# EAGLE design stm32f072-breakout (EAGLE 7.2.0)
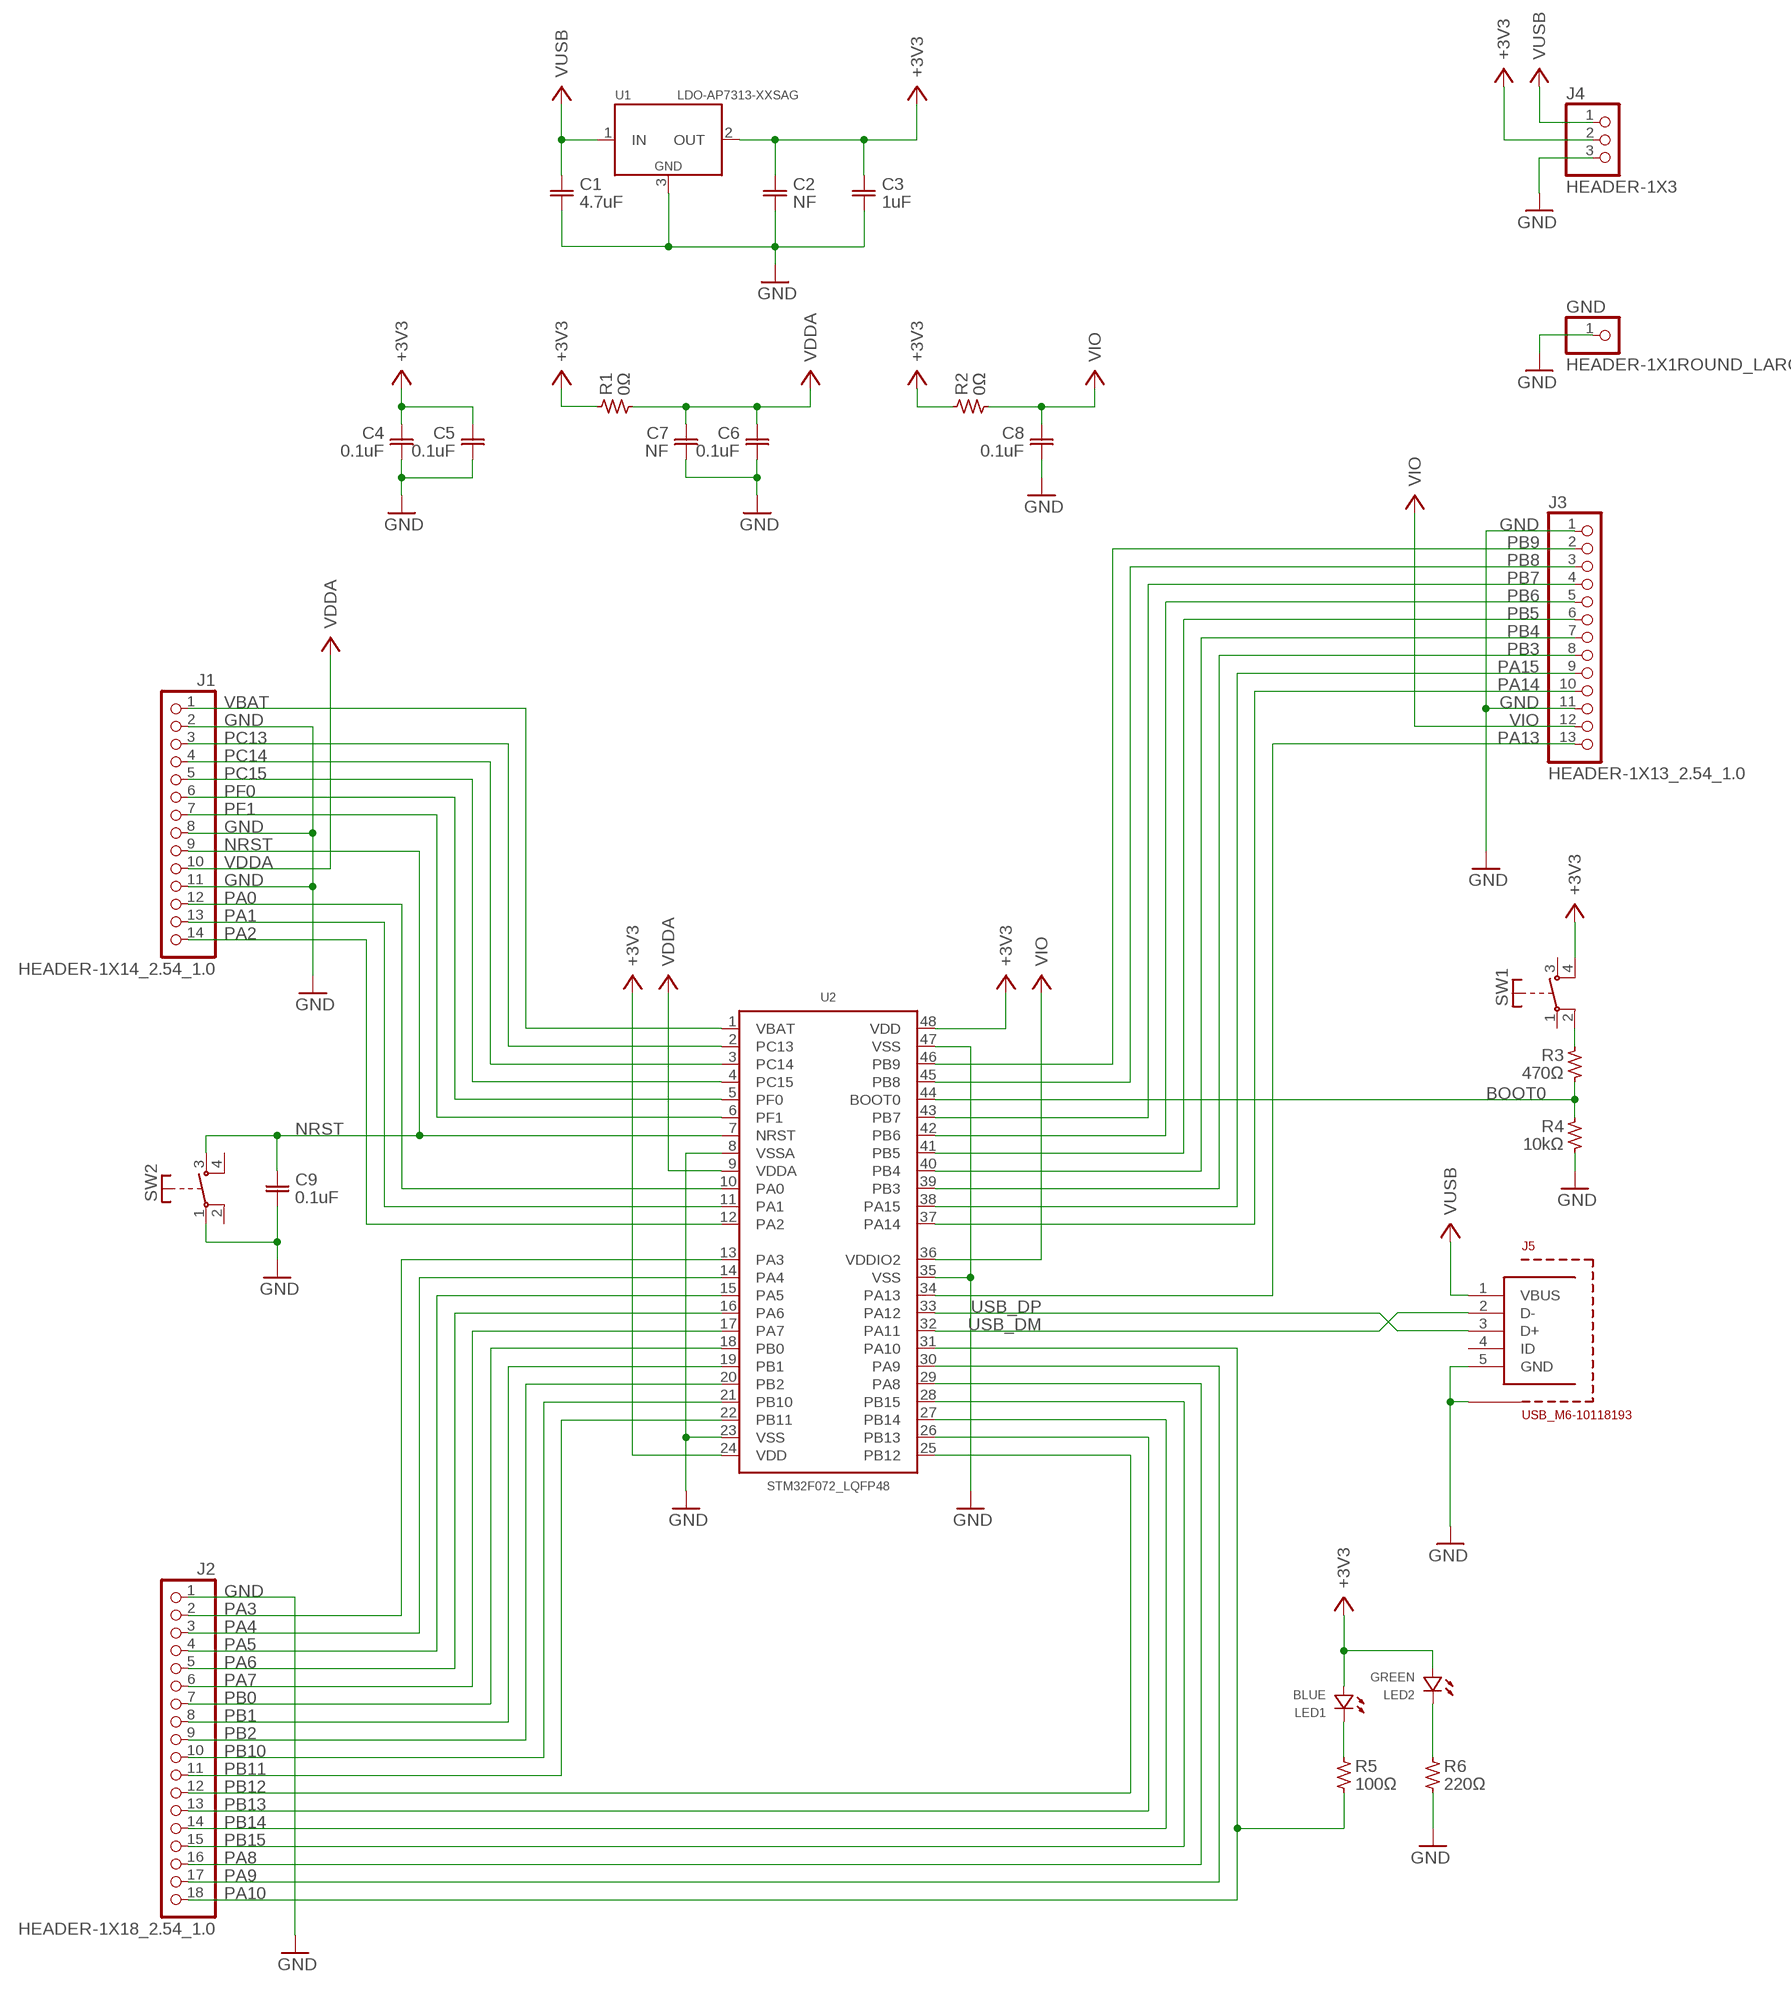
[diagram p0: schematic, sheet 1]

## Parts
C1  4.7uF  C-EU-0603  [0603]
C2  NF  C-EU-0603  [0603]
C3  1uF  C-EU-0603  [0603]
C4  0.1uF  C-EU-0603  [0603]
C5  0.1uF  C-EU-0603  [0603]
C6  0.1uF  C-EU-0603  [0603]
C7  NF  C-EU-0603  [0603]
C8  0.1uF  C-EU-0603  [0603]
C9  0.1uF  C-EU-0603  [0603]
GND  HEADER-1X1ROUND_LARGE  [1X01_ROUND_LARGE]
J1  HEADER-1X14_2.54_1.0  [1X14_OVAL]
J2  HEADER-1X18_2.54_1.0  [1X18_OVAL]
J3  HEADER-1X13_2.54_1.0  [1X13_OVAL]
J4  HEADER-1X3  [1X03_OVAL]
J5  USB_M6-10118193  [FCI-10118193]
LED1  BLUE  LED  [0603-POL]
LED2  GREEN  LED  [0603-POL]
R1  0Ω  R-US-0603  [0603]
R2  0Ω  R-US-0603  [0603]
R3  470Ω  R-US-0603  [0603]
R4  10kΩ  R-US-0603  [0603]
R5  100Ω  R-US-0603  [0603]
R6  220Ω  R-US-0603  [0603]
SW1  SWITCH_OFF(ON)_2-MJTP1140A  [MJTP1140A]
SW2  SWITCH_OFF(ON)_2-MJTP1140A  [MJTP1140A]
U1  LDO-AP7313-XXSAG  [SOT23]
U2  STM32F072_LQFP48  [LQFP48]

## Nets
+3V3: C2.1 C3.1 C4.1 C5.1 J4.2 LED1.2(A) LED2.2(A) R1.1 R2.1 SW1.4 U1.2(OUT) U2.24(VDD) U2.48(VDD)
BOOT0: R3.2 R4.1 U2.44(BOOT0)
GND: C1.2 C2.2 C3.2 C4.2 C5.2 C6.2 C7.2 C8.2 C9.2 GND.1 J1.2 J1.8 J1.11 J2.1 J3.1 J3.11 J4.3 J5.5(GND) J5.SHIELD@1(SHIELD) J5.SHIELD@2(SHIELD) J5.SHIELD@3(SHIELD) J5.SHIELD@4(SHIELD) J5.SHIELD@5(SHIELD) J5.SHIELD@6(SHIELD) J5.SHIELD@7(SHIELD) J5.SHIELD@8(SHIELD) R4.2 R6.2 SW2.1 U1.3(GND) U2.8(VSSA) U2.23(VSS) U2.35(VSS) U2.47(VSS)
N$7: R3.1 SW1.2
N$20: LED1.1(C) R5.1
N$23: LED2.1(C) R6.1
NRST: C9.1 J1.9 SW2.3 U2.7(NRST)
PA0: J1.12 U2.10(PA0)
PA1: J1.13 U2.11(PA1)
PA2: J1.14 U2.12(PA2)
PA3: J2.2 U2.13(PA3)
PA4: J2.3 U2.14(PA4)
PA5: J2.4 U2.15(PA5)
PA6: J2.5 U2.16(PA6)
PA7: J2.6 U2.17(PA7)
PA8: J2.16 U2.29(PA8)
PA9: J2.17 U2.30(PA9)
PA10: J2.18 R5.2 U2.31(PA10)
PA13: J3.13 U2.34(PA13)
PA14: J3.10 U2.37(PA14)
PA15: J3.9 U2.38(PA15)
PB0: J2.7 U2.18(PB0)
PB1: J2.8 U2.19(PB1)
PB2: J2.9 U2.20(PB2)
PB3: J3.8 U2.39(PB3)
PB4: J3.7 U2.40(PB4)
PB5: J3.6 U2.41(PB5)
PB6: J3.5 U2.42(PB6)
PB7: J3.4 U2.43(PB7)
PB8: J3.3 U2.45(PB8)
PB9: J3.2 U2.46(PB9)
PB10: J2.10 U2.21(PB10)
PB11: J2.11 U2.22(PB11)
PB12: J2.12 U2.25(PB12)
PB13: J2.13 U2.26(PB13)
PB14: J2.14 U2.27(PB14)
PB15: J2.15 U2.28(PB15)
PC13: J1.3 U2.2(PC13)
PC14: J1.4 U2.3(PC14)
PC15: J1.5 U2.4(PC15)
PF0: J1.6 U2.5(PF0)
PF1: J1.7 U2.6(PF1)
USB_DM [USB]: J5.2(D-) U2.32(PA11)
USB_DP [USB]: J5.3(D+) U2.33(PA12)
VBAT: J1.1 U2.1(VBAT)
VDDA: C6.1 C7.1 J1.10 R1.2 U2.9(VDDA)
VIO: C8.1 J3.12 R2.2 U2.36(VDDIO2)
VUSB: C1.1 J4.1 J5.1(VBUS) U1.1(IN)
Unconnected: J5.4(ID) SW1.1 SW1.3 SW2.2 SW2.4

## Library data of the parts
C1-C9 = wingel:C-EU
GND = wingel:HEADER-1X1: PIN HEADER
J1 = wingel:HEADER-1X14
J2 = wingel:HEADER-1X18
J3 = wingel:HEADER-1X13
J4 = wingel:HEADER-1X3: PIN HEADER
J5 = wingel:USB_M6
LED1 LED2 = wingel:LED
R1-R6 = wingel:R-US
SW1 SW2 = cs3:SWITCH_OFF(ON)_2: TE FSM2J - 6x6 mm SPST switch OFF-(ON)
U1 = wingel:LDO
U2 = cs3:STM32F072_LQFP48

## Net classes
0 default: width 0.152 mm, drill 0.305 mm, clearance 0.152 mm
1 USB: drill 0.406 mm, clearance 0.152 mm to class 0, clearance 0.152 mm
3 usbvcc: width 0.61 mm, drill 0.508 mm, clearance 0.152 mm to class 0, clearance 0.254 mm

## Board
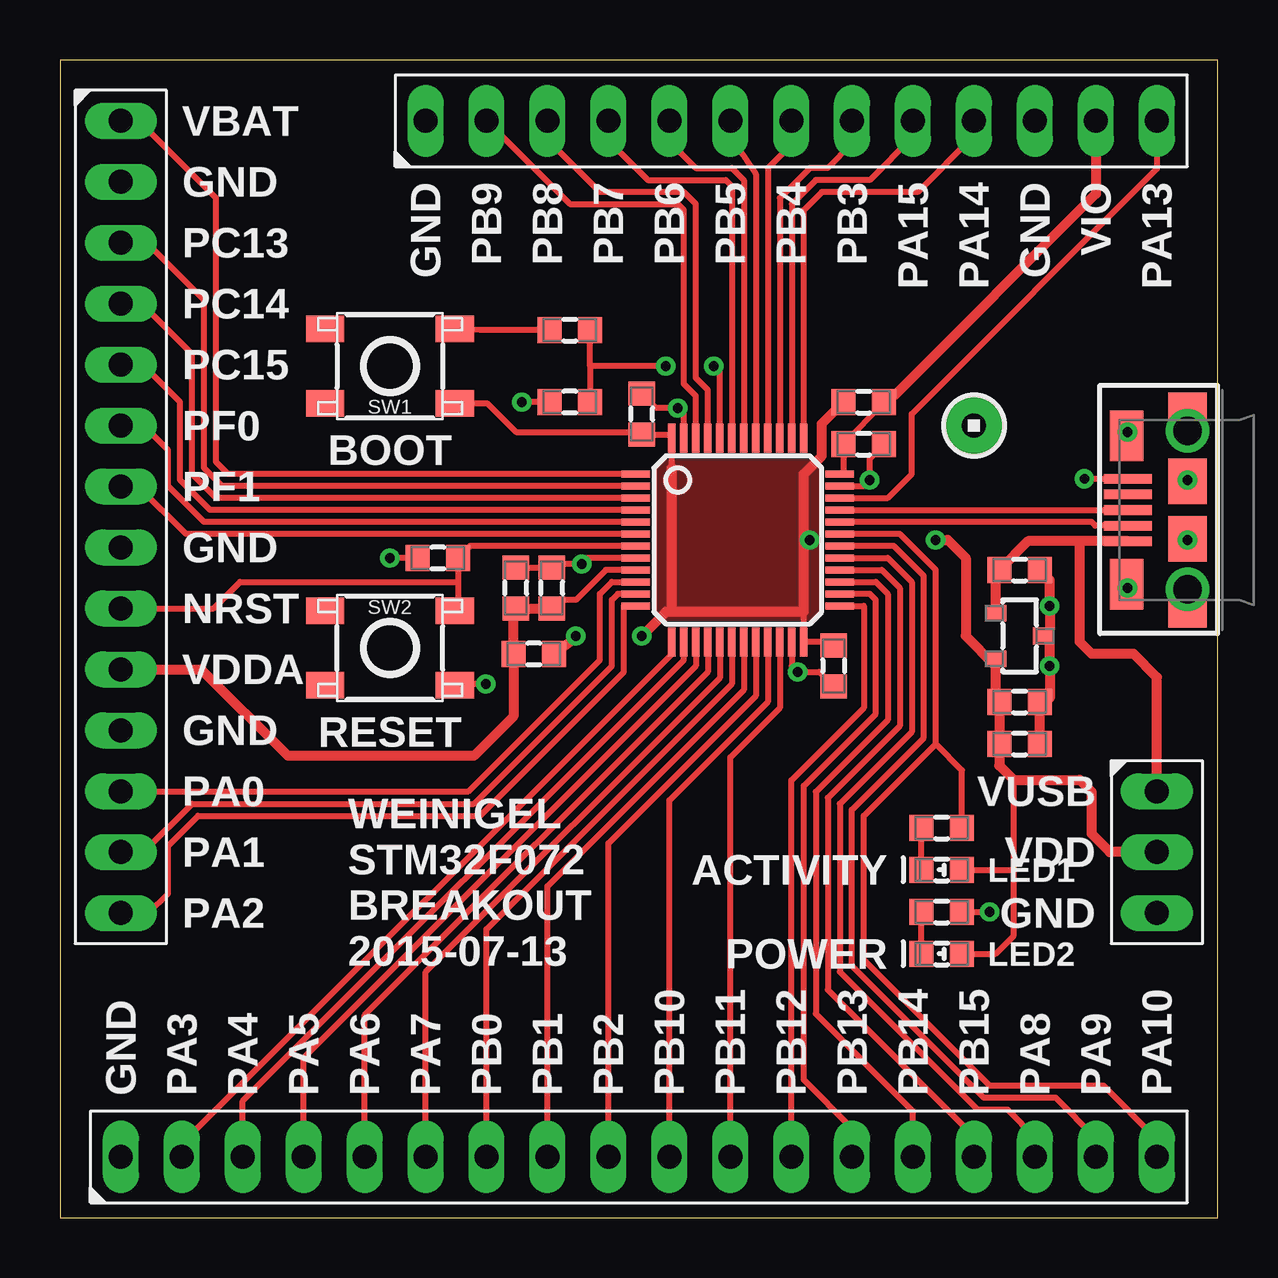
[diagram p1: board, top side]
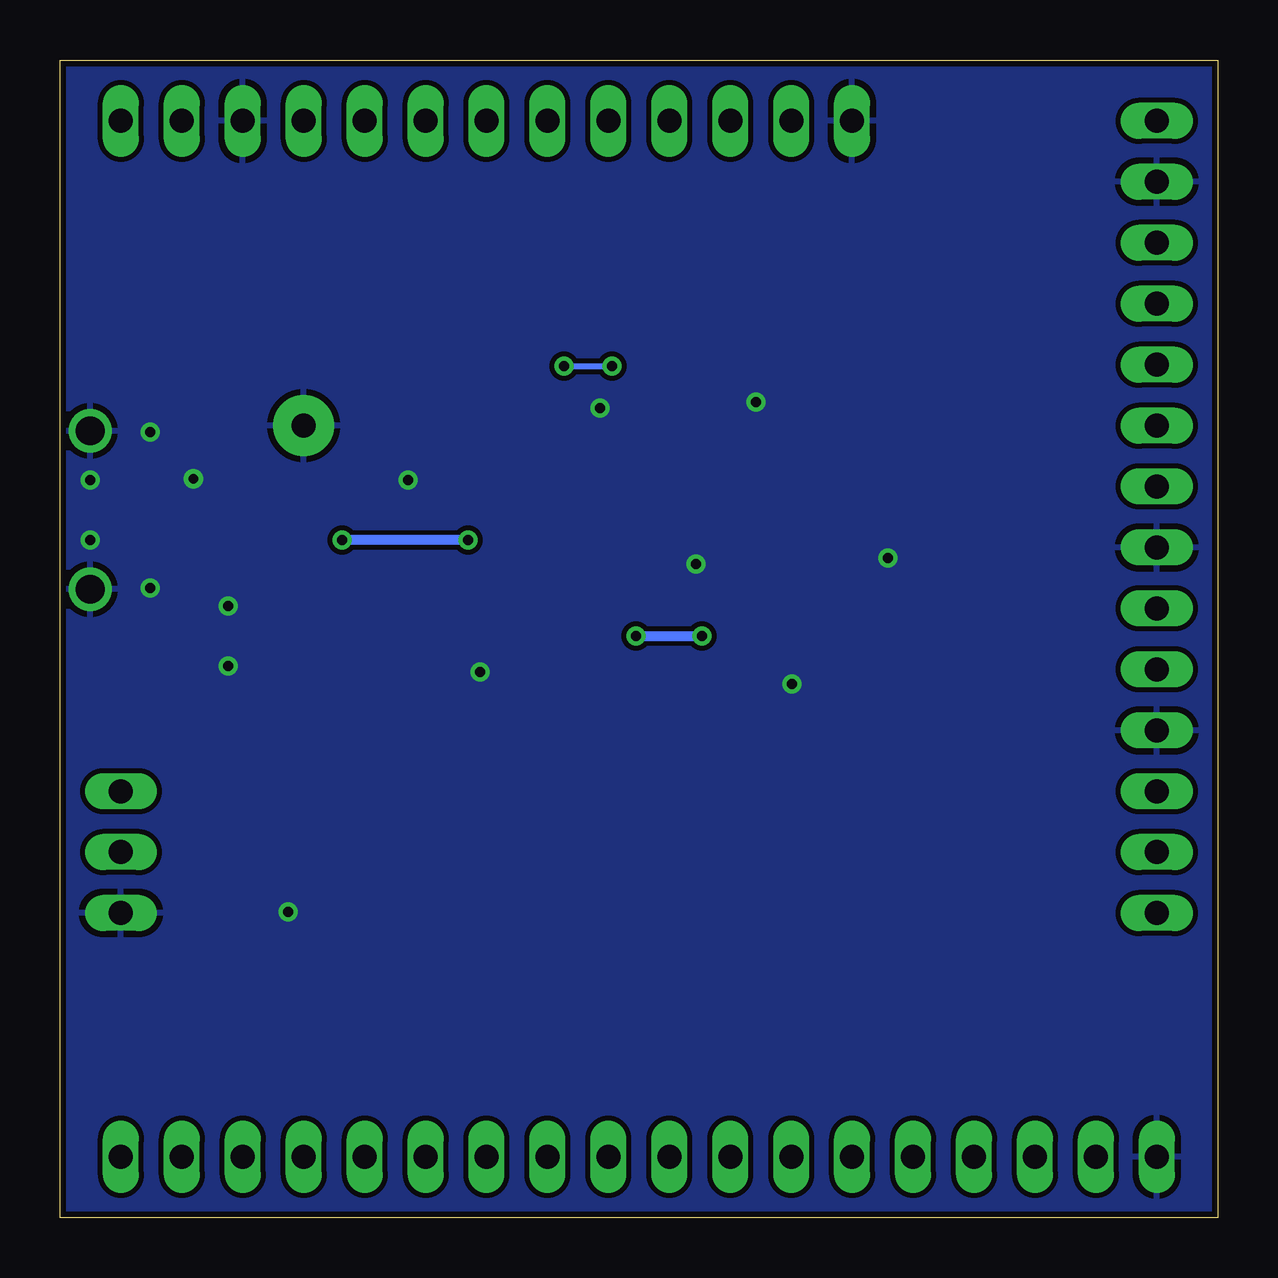
[diagram p2: board, bottom side, seen from below]

Size 48.26 x 48.26 mm. Coordinates in mm from the lower left corner, seen from the top.
Outline: 0,0 48.26,0 48.26,48.26 0,48.26 0,0
Copper layers (1*16): Top 0.035mm / dielectric 1.5mm / Bottom 0.035mm
Design rules "wingel-8mil-0.4mm-hole *": minimum track width 8mil, minimum drill 12mil, track to track 8mil, track to pad 7mil, pad to pad 7mil, via to via 8mil, smd to smd 0mil, copper to edge 10mil, drill to drill 10mil, minimum pad ring 10mil, minimum via ring 6mil, stop-mask expansion 2mil, vias tented up to drill 100mil, thermal gap 10mil

### Footprints (pad centres in the part's own frame; a part is rotated, then mirrored left to right if it is on the bottom)
0603 = smd 1 x 1.1: 1 -0.85,0; 2 0.85,0
1X01_ROUND_LARGE = drill 1 pad 2.54: 1 0,0
1X14_OVAL = drill 1 long: 1 0,0; 2 2.54,0; 3 5.08,0; 4 7.62,0; 5 10.16,0; 6 12.7,0; 7 15.24,0; 8 17.78,0; 9 20.32,0; 10 22.86,0; 11 25.4,0; 12 27.94,0; 13 30.48,0; 14 33.02,0
1X18_OVAL = drill 1 long: 1 0,0; 2 2.54,0; 3 5.08,0; 4 7.62,0; 5 10.16,0; 6 12.7,0; 7 15.24,0; 8 17.78,0; 9 20.32,0; 10 22.86,0; 11 25.4,0; 12 27.94,0; 13 30.48,0; 14 33.02,0; 15 35.56,0; 16 38.1,0; 17 40.64,0; 18 43.18,0
1X13_OVAL = drill 1 long: 1 0,0; 2 2.54,0; 3 5.08,0; 4 7.62,0; 5 10.16,0; 6 12.7,0; 7 15.24,0; 8 17.78,0; 9 20.32,0; 10 22.86,0; 11 25.4,0; 12 27.94,0; 13 30.48,0
1X03_OVAL = drill 1 long: 1 0,0; 2 2.54,0; 3 5.08,0
FCI-10118193 = smd 0.4 x 2: 1 -1.3,2.5; 2 -0.65,2.5; 3 0,2.5; 4 0.65,2.5; 5 1.3,2.5 | smd 2.1 x 1.4: SHIELD@1 -3.1,2.55; SHIELD@2 3.1,2.55 | smd 1.8 x 1.6: SHIELD@3 -4,0; SHIELD@4 4,0 | smd 1.9 x 1.6: SHIELD@5 -1.2,0; SHIELD@6 1.2,0 | drill 1.2 pad 1.6: SHIELD@7 -3.3,0; SHIELD@8 3.3,0
0603-POL = smd 1 x 1.1: 1 -0.85,0; 2 0.85,0
MJTP1140A = smd 1.6 x 1.1: 1 -2.7,1.55; 2 2.7,1.55; 3 -2.7,-1.55; 4 2.7,-1.55
SOT23 = smd 0.7 x 0.9: 1 -0.95,-1; 2 0.95,-1; 3 0,1
LQFP48 = smd 1.2 x 0.3: 1 -4.25,2.75; 2 -4.25,2.25; 3 -4.25,1.75; 4 -4.25,1.25; 5 -4.25,0.75; 6 -4.25,0.25; 7 -4.25,-0.25; 8 -4.25,-0.75; 9 -4.25,-1.25; 10 -4.25,-1.75; 11 -4.25,-2.25; 12 -4.25,-2.75; 25 4.25,-2.75; 26 4.25,-2.25; 27 4.25,-1.75; 28 4.25,-1.25; 29 4.25,-0.75; 30 4.25,-0.25; 31 4.25,0.25; 32 4.25,0.75; 33 4.25,1.25; 34 4.25,1.75; 35 4.25,2.25; 36 4.25,2.75 | smd 0.3 x 1.2: 13 -2.75,-4.25; 14 -2.25,-4.25; 15 -1.75,-4.25; 16 -1.25,-4.25; 17 -0.75,-4.25; 18 -0.25,-4.25; 19 0.25,-4.25; 20 0.75,-4.25; 21 1.25,-4.25; 22 1.75,-4.25; 23 2.25,-4.25; 24 2.75,-4.25; 37 2.75,4.25; 38 2.25,4.25; 39 1.75,4.25; 40 1.25,4.25; 41 0.75,4.25; 42 0.25,4.25; 43 -0.25,4.25; 44 -0.75,4.25; 45 -1.25,4.25; 46 -1.75,4.25; 47 -2.25,4.25; 48 -2.75,4.25

### Placement (x,y rotation side)
C1  40,27 0 top
C2  40,21.5 0 top
C3  40,19.75 0 top
C4  32.25,23 270 top
C5  24.25,33.5 90 top
C6  20.5,26.25 90 top
C7  19,26.25 90 top
C8  33.5,32.25 0 top
C9  15.75,27.5 180 top
GND  38.1,33.02 0 top
J1  2.54,45.72 270 top
J2  2.54,2.54 0 top
J3  15.24,45.72 0 top
J4  45.72,17.78 270 top
J5  47,29.5 90 top
LED1  36.75,14.5 0 top
LED2  36.75,11 0 top
R1  19.75,23.5 180 top
R2  33.5,34 0 top
R3  21.25,37 0 top
R4  21.25,34 180 top
R5  36.75,16.25 0 top
R6  36.75,12.75 0 top
SW1  13.75,35.5 0 top
SW2  13.75,23.75 180 top
U1  40,24.25 270 top
U2  28.25,28.25 0 top

### Tracks (layer width: path | path; a pad name or v marks a point on that pad's centre or on a via)
+3V3  (via drill 0.4 pad 0.8)
  Top 0.254: 31,25.25 U2.24 32,24 C4.1 | U1.2 38.95,23.05 | LED2.2 39,11 39.75,11.75 39.75,14.5 | 39.75,14.5 39.75,18.25 | LED1.2 39.75,14.5 | SW1.4 17.8,33.95 19,32.75 24.4,32.75 C5.1 25.5,32.65 U2.48 25.5,31.25 | v21.5,24.25 21.6,24.25
  Top 0.406: v24.25,24.25 25.25,25.25 25.5,25.25 | 25.5,25.25 31,25.25 31,28.25 | 31,28.25 31,31 31.75,31.75 31.75,33.1 R2.1 | C2.1 C3.1 | U1.2 39,21.4 C2.1 | 38.95,23.05 37.75,24.25 37.75,27.5 37,28.25 v36.5,28.25 | C2.1 39.15,18.85 39.75,18.25 42.5,18.25 43,17.75 43,16 43.76,15.24 J4.2 | 21.6,24.25 R1.1 | 25.5,25.25 25.5,31.25 | 31,28.25 v31.25,28.25
  Bottom 0.406: v24.25,24.25 v21.5,24.25 | v31.25,28.25 v36.5,28.25
  pour Top: 25.25,31.5 31.25,31.5 31.5,31.25 31.5,25.25 31.25,25 25.25,25 25,25.25 25,31.25
BOOT0  (via drill 0.4 pad 0.8)
  Top 0.254: v25.25,35.5 22.1,35.5 | 22.1,35.5 R4.1 | U2.44 27.5,35.25 v27.25,35.5 | 22.1,35.5 R3.2
  Bottom 0.254: v27.25,35.5 v25.25,35.5
GND  (via drill 0.4 pad 0.8)
  Top 0.254: U2.23 30.5,23 v30.75,22.75 31.65,22.75 C4.2 | U2.8 22,27.5 v21.75,27.25 20.85,27.25 C6.2 C7.2 | C5.2 24.85,33.75 v25.75,33.75 26,33.5 U2.47 | C8.2 33.75,31.65 v33.75,30.75 33.5,30.5 U2.35 | 41.25,26.6 C1.2 | 41.25,24.5 U1.3 41.25,24 | R6.2 v38.75,12.75 | C9.2 v13.75,27.5 | R4.2 v19.25,34 | 47,34 J5.SHIELD@4 J5.SHIELD@8 47,33 | 46.5,25 J5.SHIELD@3 J5.SHIELD@7 | 44.45,26.05 J5.SHIELD@1 44.45,26.3 v44.5,26.25 | 44.45,32.95 J5.SHIELD@2 44.5,32.65 v44.5,32.75 | J5.5 v42.7,30.8 | J5.SHIELD@5 v47,28.25 | v47,30.75 J5.SHIELD@6 | v17.75,22.25 16.5,22.25 SW2.1
  Top 0.406: 41.25,24.5 v41.25,25.5 41.25,26.6 | 41.25,24 v41.25,23 41.25,21.65 C2.2 C3.2
  pour Bottom: -1,49 -1,-1 48.75,-1 49,49
N$7
  Top 0.254: R3.1 17.5,37 SW1.2
N$20
  Top 0.254: LED1.1 R5.1
N$23
  Top 0.254: LED2.1 R6.1
NRST
  Top 0.254: U2.7 17.1,28 C9.1 16.6,26.5 | 16.6,26.5 16.6,25.45 SW2.3 | J1.9 6.4,25.4 7.5,26.5 16.6,26.5
PA0
  Top 0.254: J1.12 17.03,17.78 22.5,23.25 22.5,26 23,26.5 U2.10
PA1
  Top 0.254: U2.11 23.25,26 23,25.75 23,23 17.25,17.25 5.5,17.25 3.49,15.24 J1.13
PA2
  Top 0.254: U2.12 23.5,25.5 23.5,22.75 17.5,16.75 5.75,16.75 4.5,15.5 4.5,13.5 3.7,12.7 J1.14
PA3
  Top 0.254: J2.2 5.08,3.08 25.5,23.5 U2.13
PA4
  Top 0.254: J2.3 7.62,4.87 26,23.25 U2.14
PA5
  Top 0.254: U2.15 26.5,23 10.16,6.66 J2.4
PA6
  Top 0.254: U2.16 27,22.75 12.7,8.45 J2.5
PA7
  Top 0.254: U2.17 27.5,22.5 15.24,10.24 J2.6
PA8
  Top 0.254: U2.29 34.5,27.5 35.5,26.5 35.5,20.25 32.5,17.25 32.5,10.25 38.25,4.5 39.5,4.5 40.64,3.36 J2.16
PA9
  Top 0.254: J2.17 43.18,3.32 41.5,5 38.5,5 33,10.5 33,17 36,20 36,26.75 34.75,28 U2.30
PA10
  Top 0.254: J2.18 45.72,3.28 43.5,5.5 38.75,5.5 33.5,10.75 33.5,16.75 36.5,19.75 | 36.5,19.75 36.5,27 35,28.5 U2.31 | R5.2 37.6,18.65 36.5,19.75
PA13
  Top 0.254: U2.34 34.5,30 35.5,31 35.5,33.5 45.72,43.72 J3.13
PA14
  Top 0.254: U2.37 31,42 31.75,42.75 35.75,42.75 38.1,45.1 J3.10
PA15
  Top 0.254: J3.9 35.56,45.06 33.75,43.25 31.5,43.25 30.5,42.25 U2.38
PB0
  Top 0.254: U2.18 28,22.25 17.78,12.03 J2.7
PB1
  Top 0.254: U2.19 28.5,22 20.32,13.82 J2.8
PB2
  Top 0.254: U2.20 29,21.75 22.86,15.61 J2.9
PB3
  Top 0.254: J3.8 33.02,44.77 32,43.75 31.25,43.75 30,42.5 U2.39
PB4
  Top 0.254: J3.7 30.48,44.73 29.5,43.75 U2.40
PB5
  Top 0.254: J3.6 27.94,45.06 29,43.5 U2.41
PB6
  Top 0.254: J3.5 25.4,44.85 26.5,43.75 28,43.75 28.5,43.25 U2.42
PB7
  Top 0.254: J3.4 22.86,44.89 24.5,43.25 27.75,43.25 28,43 U2.43
PB8
  Top 0.254: J3.3 20.32,44.93 22.5,42.75 26,42.75 26.5,42.25 26.5,35 27,34.5 U2.45
PB9
  Top 0.254: J3.2 21.25,42.25 25.75,42.25 26,42 26,34.75 26.5,34.25 U2.46
PB10
  Top 0.254: J2.10 25.4,17.4 29.5,21.5 U2.21
PB11
  Top 0.254: U2.22 30,21.25 27.94,19.19 J2.11
PB12
  Top 0.254: U2.25 33.5,25.5 33.5,21.25 30.48,18.23 J2.12
PB13
  Top 0.254: J2.13 33.02,3.73 31,5.75 31,18 34,21 34,25.75 33.75,26 U2.26
PB14
  Top 0.254: U2.27 34,26.5 34.5,26 34.5,20.75 31.5,17.75 31.5,8.5 35.56,4.44 J2.14
PB15
  Top 0.254: U2.28 34.25,27 35,26.25 35,20.5 32,17.5 32,9.5 38.1,3.4 J2.15
PC13
  Top 0.254: U2.2 6.75,30.5 6,31.25 6,38.25 3.61,40.64 J1.3
PC14
  Top 0.254: U2.3 6.5,30 5.5,31 5.5,36 3.4,38.1 J1.4
PC15
  Top 0.254: U2.4 6.25,29.5 5,30.75 5,34 3.44,35.56 J1.5
PF0
  Top 0.254: U2.5 6,29 4.5,30.5 4.5,32 3.48,33.02 J1.6
PF1
  Top 0.254: U2.6 5.25,28.5 3.27,30.48 J1.7
USB_DM
  Top 0.254: J5.2 43.15,28.85 43,29 U2.32
USB_DP
  Top 0.254: U2.33 J5.3
VBAT
  Top 0.254: U2.1 7,31 6.5,31.5 6.5,42.5 3.28,45.72 J1.1
VDDA
  Top 0.254: U2.9 22.75,27 21.5,25.75 21.1,25.75 C6.1 | 18.9,25.3 C7.1
  Top 0.406: C7.1 C6.1 | J1.10 5.89,22.86 9.5,19.25 17.25,19.25 18.9,20.9 R1.2 18.9,25.3
VIO
  Top 0.254: U2.36 32.65,31 C8.1 R2.2 34.75,34.15 34.75,34.25
  Top 0.406: J3.12 43.18,42.68 34.75,34.25
VUSB
  Top 0.254: 39,26.85 C1.1
  Top 0.406: U1.1 39,26.85 | J5.1 42.5,28.2 | 42.5,28.2 40.35,28.2 C1.1 | J4.1 45.72,22.53 44.75,23.5 43,23.5 42.5,24 42.5,28.2

### Text on the board
tPlace: VBAT | GND | GND | PB9 | PB8 | PB7 | PB6 | PB5 | PB4 | PB3 | PA15 | PA14 | GND | VIO | PA13 | PC13 | PC14 | PC15 | PF0 | BOOT | PF1 | GND | NRST | VDDA | GND | RESET | PA0 | VUSB | PA1 | VDD | ACTIVITY | PA2 | GND | POWER | WEINIGEL / STM32F072 / BREAKOUT / 2015-07-13 | GND | PA3 | PA4 | PA5 | PA6 | PA7 | PB0 | PB1 | PB2 | PB10 | PB11 | PB12 | PB13 | PB14 | PB15 | PA8 | PA9 | PA10